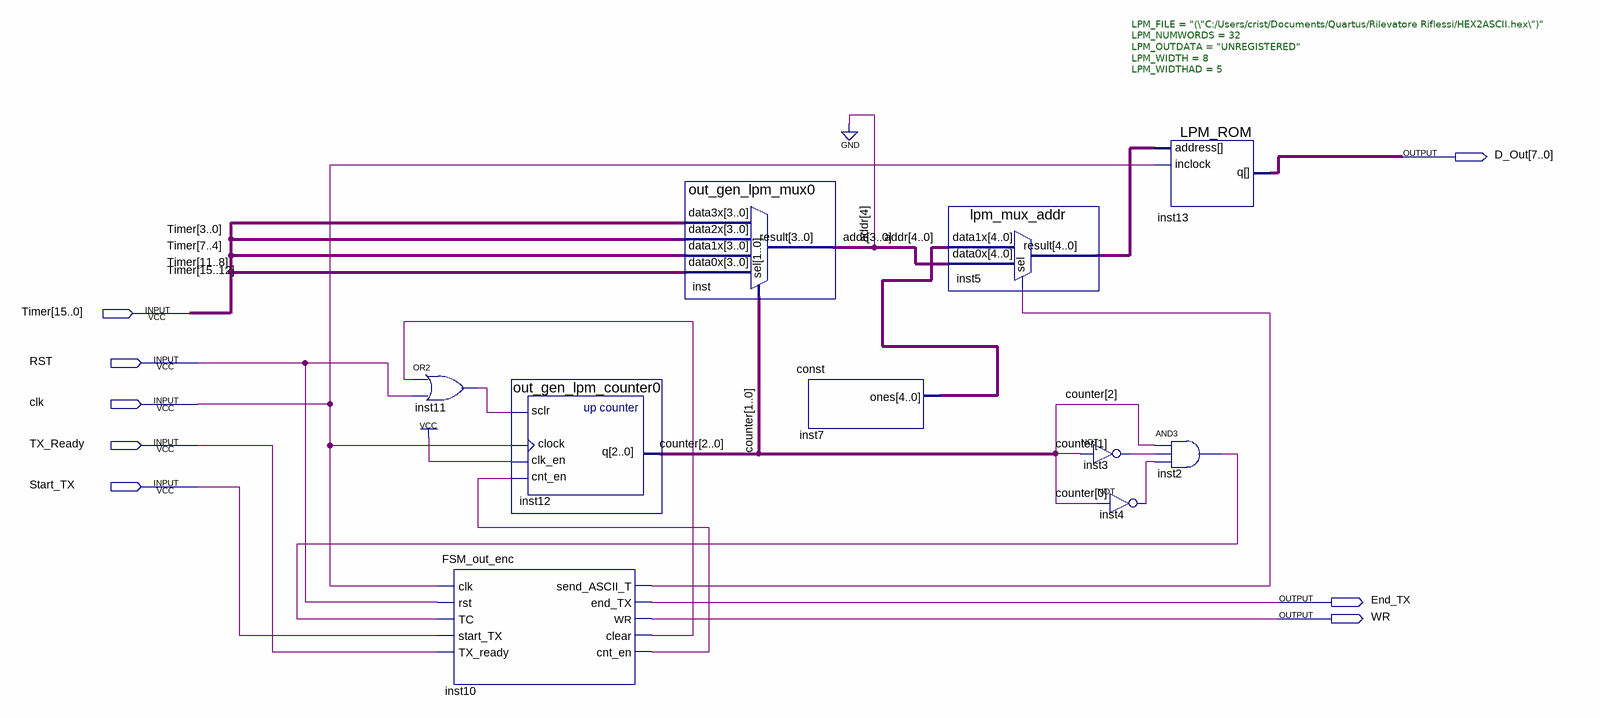
[diagram p0: schematic sheet]
// Quartus schematic output_encoder.bdf as structural Verilog: 10 symbols, 8 pins
module output_encoder (
  input  [15:0] Timer,
  input  RST,
  input  clk,
  input  TX_Ready,
  input  Start_TX,
  output [7:0] D_Out,
  output End_TX,
  output WR
);

  wire inst2_out, inst3_out, inst4_out, inst10_clear, inst10_cnt_en, inst10_send_ascii_t, inst11_out;
  wire [2:0] counter;
  wire [3:0] addr;
  wire [4:0] inst5_result, inst7_ones;

  or inst11 (inst11_out, inst10_clear, RST);
  FSM_out_enc inst10 (
    .clk(clk), .rst(RST), .TC(inst2_out), .start_TX(Start_TX), .TX_ready(TX_Ready),
    .send_ASCII_T(inst10_send_ascii_t), .end_TX(End_TX), .WR(WR), .clear(inst10_clear), .cnt_en(inst10_cnt_en));
  out_gen_lpm_counter0 inst12 (.sclr(inst11_out), .clock(clk), .clk_en(1'b1), .cnt_en(inst10_cnt_en), .q(counter));
  out_gen_lpm_mux0 inst (
    .data3x(Timer[3:0]), .data2x(Timer[7:4]), .data1x(Timer[11:8]), .data0x(Timer[15:12]),
    .sel(counter[1:0]), .result(addr));
  \const  inst7 (.ones(inst7_ones));
  lpm_mux_addr inst5 (.data1x(inst7_ones), .data0x({1'b0, addr}), .sel(inst10_send_ascii_t), .result(inst5_result));
  not inst3 (inst3_out, counter[1]);
  not inst4 (inst4_out, counter[0]);
  LPM_ROM #(.LPM_FILE("(\"C:/Users/crist/Documents/Quartus/Rilevatore Riflessi/HEX2ASCII.hex\")"), .LPM_NUMWORDS(32), .LPM_OUTDATA("UNREGISTERED"), .LPM_WIDTH(8), .LPM_WIDTHAD(5)) inst13 (
    .address(inst5_result), .inclock(clk), .q(D_Out));
  and inst2 (inst2_out, counter[2], inst3_out, inst4_out);
endmodule
